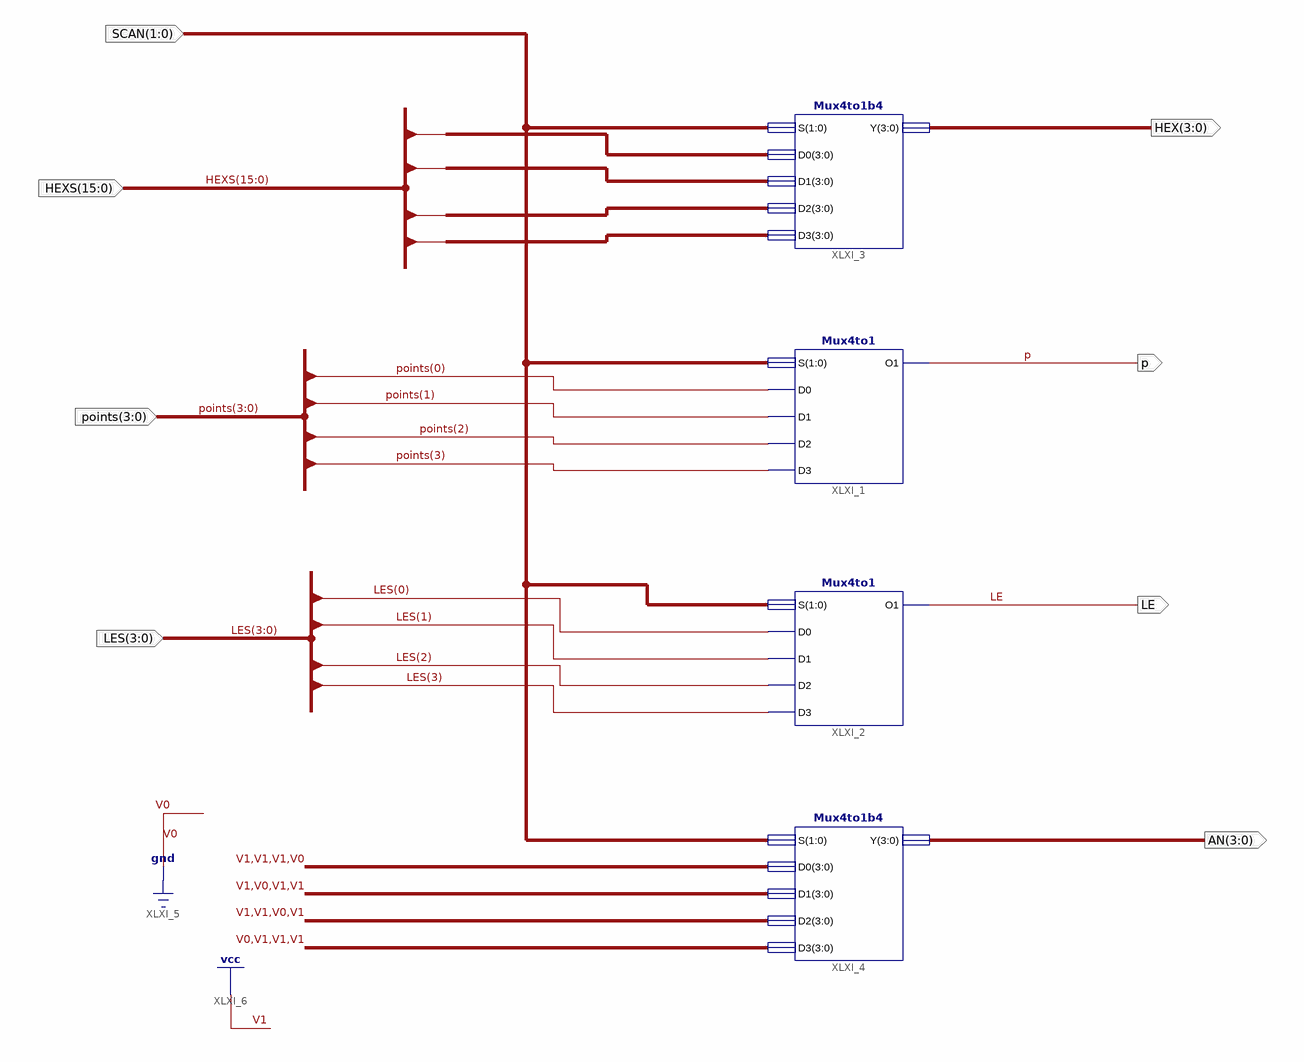
[diagram p0: schematic sheet 1]
// Xilinx ISE schematic DisplaySync.sch (kintex7) as structural Verilog: 4 symbols, 8 ports
module DisplaySync (
  input  [3:0] points,
  input  [3:0] LES,
  input  [1:0] SCAN,
  input  [15:0] HEXS,
  output [3:0] HEX,
  output p,
  output LE,
  output [3:0] AN
);

  Mux4to1 XLXI_1 (.S(SCAN), .D0(points[0]), .D1(points[1]), .D2(points[2]), .D3(points[3]), .O1(p));
  Mux4to1 XLXI_2 (.S(SCAN), .D0(LES[0]), .D1(LES[1]), .D2(LES[2]), .D3(LES[3]), .O1(LE));
  Mux4to1b4 XLXI_3 (.S(SCAN), .D0(HEXS[3:0]), .D1(HEXS[7:4]), .D2(HEXS[11:8]), .D3(HEXS[15:12]), .Y(HEX));
  Mux4to1b4 XLXI_4 (.S(SCAN), .D0(4'b1110), .D1(4'b1011), .D2(4'b1101), .D3(4'b0111), .Y(AN));
endmodule
